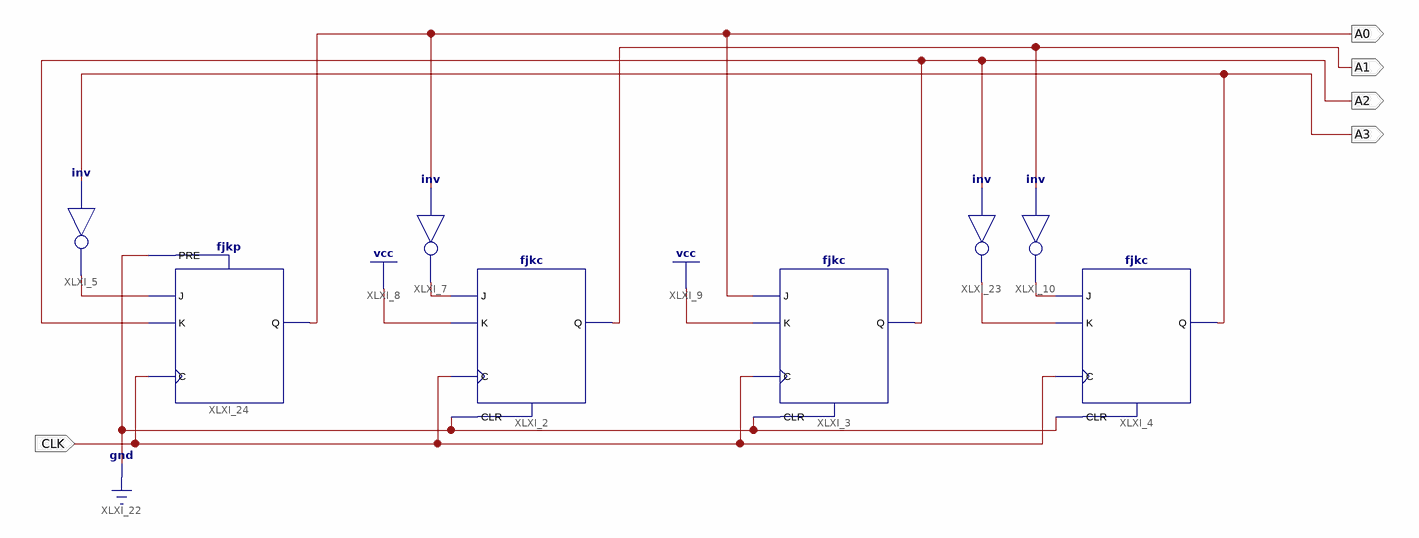
[diagram p0: schematic sheet 1]
// Xilinx ISE schematic counter1d82.sch (spartan6) as structural Verilog: 8 symbols, 5 ports
module counter1d82 (
  input  CLK,
  output A1,
  output A3,
  output A0,
  output A2
);

  wire XLXN_1, XLXN_4, XLXN_8, XLXN_30;

  fjkc XLXI_2 (.C(CLK), .CLR(1'b0), .J(XLXN_4), .K(1'b1), .Q(A1));
  fjkc XLXI_3 (.C(CLK), .CLR(1'b0), .J(A0), .K(1'b1), .Q(A2));
  fjkc XLXI_4 (.C(CLK), .CLR(1'b0), .J(XLXN_8), .K(XLXN_30), .Q(A3));
  not XLXI_5 (XLXN_1, A3);
  not XLXI_7 (XLXN_4, A0);
  not XLXI_10 (XLXN_8, A1);
  not XLXI_23 (XLXN_30, A2);
  fjkp XLXI_24 (.C(CLK), .J(XLXN_1), .K(A2), .PRE(1'b0), .Q(A0));
endmodule
